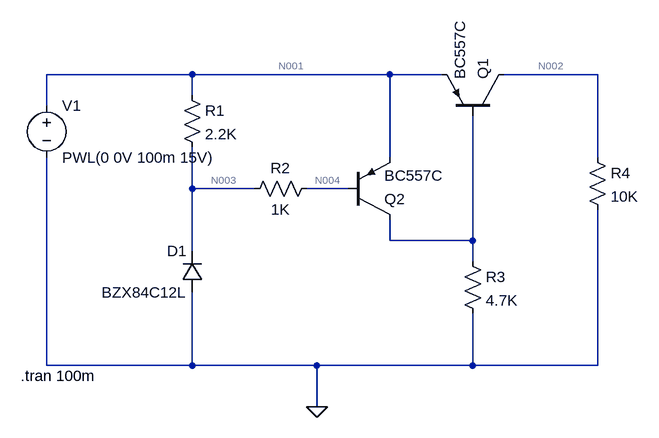
[diagram p0: schematic Draft4.asc]
Draft4.asc, the LTspice schematic file:
Version 4.1
SHEET 1 980 680
WIRE 288 80 64 80
WIRE 592 80 288 80
WIRE 672 80 592 80
WIRE 912 80 768 80
WIRE 288 112 288 80
WIRE 64 128 64 80
WIRE 592 208 592 80
WIRE 912 208 912 80
WIRE 288 256 288 192
WIRE 384 256 288 256
WIRE 528 256 464 256
WIRE 592 336 592 304
WIRE 720 336 720 144
WIRE 720 336 592 336
WIRE 288 352 288 256
WIRE 720 368 720 336
WIRE 64 528 64 208
WIRE 288 528 288 416
WIRE 288 528 64 528
WIRE 480 528 288 528
WIRE 720 528 720 448
WIRE 720 528 480 528
WIRE 912 528 912 288
WIRE 912 528 720 528
WIRE 480 592 480 528
FLAG 480 592 0
SYMBOL voltage 64 112 R0
WINDOW 123 0 0 Left 0
WINDOW 39 0 0 Left 0
SYMATTR InstName V1
SYMATTR Value PWL(0 0V 100m 15V)
SYMBOL diode 304 416 R180
WINDOW 0 24 64 Left 2
WINDOW 3 24 0 Left 2
SYMATTR InstName D1
SYMATTR Value BZX84C12L
SYMATTR Description Diode
SYMATTR Type diode
SYMBOL res 272 96 R0
SYMATTR InstName R1
SYMATTR Value 2.2K
SYMBOL res 480 240 R90
WINDOW 0 0 56 VBottom 2
WINDOW 3 32 56 VTop 2
SYMATTR InstName R2
SYMATTR Value 1K
SYMBOL pnp 768 144 M270
SYMATTR InstName Q1
SYMATTR Value BC557C
SYMBOL pnp 528 304 M180
SYMATTR InstName Q2
SYMATTR Value BC557C
SYMBOL res 704 352 R0
SYMATTR InstName R3
SYMATTR Value 4.7K
SYMBOL res 896 192 R0
SYMATTR InstName R4
SYMATTR Value 10K
TEXT 24 544 Left 2 !.tran 100m

The netlist it stands for:
* Draft4.asc
V1 N001 0 PWL(0 0V 100m 15V)
D1 0 N003 BZX84C12L
R1 N001 N003 2.2K
R2 N004 N003 1K
Q1 N002 N005 N001 0 BC557C
Q2 N005 N004 N001 0 BC557C
R3 N005 0 4.7K
R4 N002 0 10K
.model D D
.lib standard.dio
.model NPN NPN
.model PNP PNP
.lib standard.bjt
.tran 100m
.backanno
.end

* Results of the author's LTspice run, read from the files saved beside the schematic
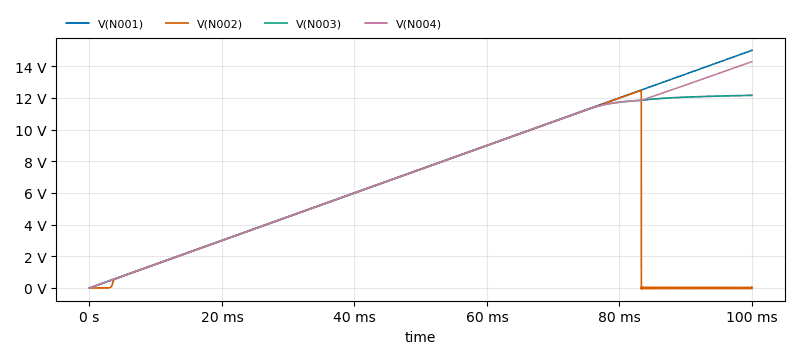
[diagram p1: Transient Analysis of Draft4.asc, plotted from the saved traces]
* Transient Analysis, 1 run:
*   V(N001): min 0 V, max 15 V, average 7.5 V, rms 8.742 V, last 15 V
*   V(N002): min -52.52 mV, max 12.47 V, average 5.189 V, rms 6.685 V, last 40.5 mV
*   V(N003): min 0 V, max 12.16 V, average 7.197 V, rms 8.28 V, last 12.16 V
*   V(N004): min 0 V, max 14.29 V, average 7.365 V, rms 8.536 V, last 14.29 V